# EAGLE schematic Lichtsteuerung_ControlUnit (EAGLE 9.6.2)
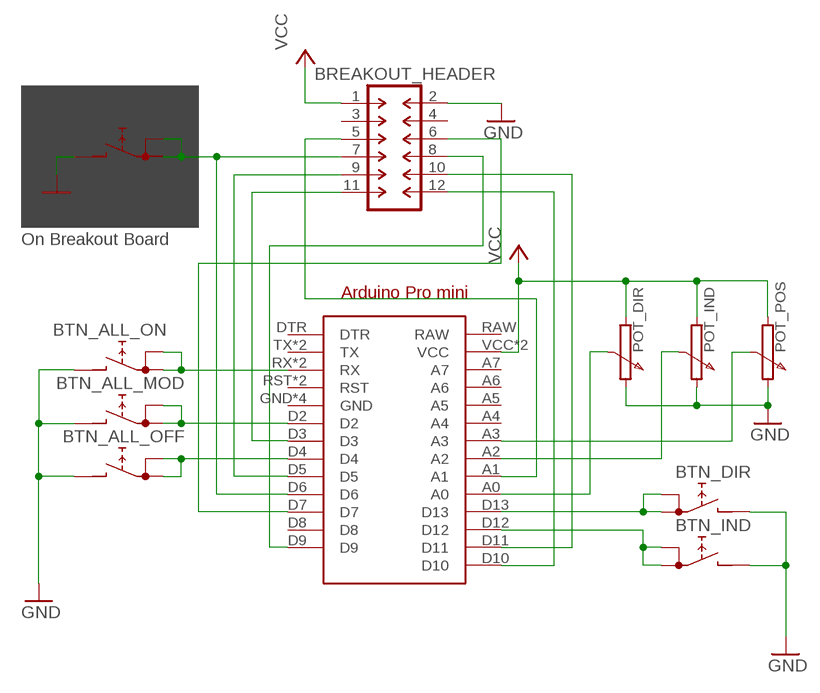
[diagram p0: schematic, sheet 1]

## Parts
ARDUINO1  1  ARDUINO_PRO_MINI  [ARDUINO_PRO_MINI]
BREAKOUT_HEADER  M-2X06-DIL-2MM_M  [DIL-2MM-2X06_M]
BTN_ALL_MOD  RDT1034  [RDT1034]
BTN_ALL_OFF  RDT1034  [RDT1034]
BTN_ALL_ON  RDT1034  [RDT1034]
BTN_DIR  RDT1034  [RDT1034]
BTN_ENT  RDT1034  [RDT1034]
BTN_IND  RDT1034  [RDT1034]

## Nets
GND: BREAKOUT_HEADER.2 BTN_ALL_MOD.B BTN_ALL_OFF.B BTN_ALL_ON.B BTN_DIR.B BTN_ENT.B BTN_IND.B
N$1: ARDUINO1.D2 BTN_ALL_MOD.A BTN_ALL_MOD.A1
N$2: ARDUINO1.RX ARDUINO1.RX@1(RX) BTN_ALL_ON.A BTN_ALL_ON.A1
N$3: ARDUINO1.D4 BTN_ALL_OFF.A BTN_ALL_OFF.A1
N$4: ARDUINO1.D12 BTN_IND.A BTN_IND.A1
N$5: ARDUINO1.A3
N$6: ARDUINO1.D13 BTN_DIR.A BTN_DIR.A1
N$7: ARDUINO1.A1 BREAKOUT_HEADER.5
N$8: ARDUINO1.A2
N$9: ARDUINO1.A0
N$10: ARDUINO1.D7 BREAKOUT_HEADER.6
N$11: ARDUINO1.D6 BREAKOUT_HEADER.7 BTN_ENT.A BTN_ENT.A1
N$12: ARDUINO1.D5 BREAKOUT_HEADER.9
N$13: ARDUINO1.D3 BREAKOUT_HEADER.11
N$14: ARDUINO1.D9 BREAKOUT_HEADER.8
N$15: ARDUINO1.D11 BREAKOUT_HEADER.10
N$16: ARDUINO1.D10 BREAKOUT_HEADER.12
VCC: ARDUINO1.VCC ARDUINO1.VCC@1(VCC) BREAKOUT_HEADER.1
Unconnected: ARDUINO1.A4 ARDUINO1.A5 ARDUINO1.A6 ARDUINO1.A7 ARDUINO1.D8 ARDUINO1.DTR ARDUINO1.RAW ARDUINO1.RST ARDUINO1.RST@1(RST) ARDUINO1.TX ARDUINO1.TX@1(TX) BREAKOUT_HEADER.3 BREAKOUT_HEADER.4

## Notes on the sheet
- On Breakout Board
- POT_DIR | POT_IND | POT_POS

## Power pins joined to a net without a drawn wire
GND: ARDUINO1.GND ARDUINO1.GND@1(GND) ARDUINO1.GND@2(GND) ARDUINO1.GND@3(GND)

## Library data of the parts
ARDUINO1 = arduinopromini:ARDUINO_PRO_MINI: For creating Arduino Pro Mini shields
BREAKOUT_HEADER = con-headers-jp:M-2X06-: MALE HEADER
BTN_ALL_MOD BTN_ALL_OFF BTN_ALL_ON BTN_DIR BTN_ENT BTN_IND = switch:RDT1034: PUSH SWITCH www.radiohm.com